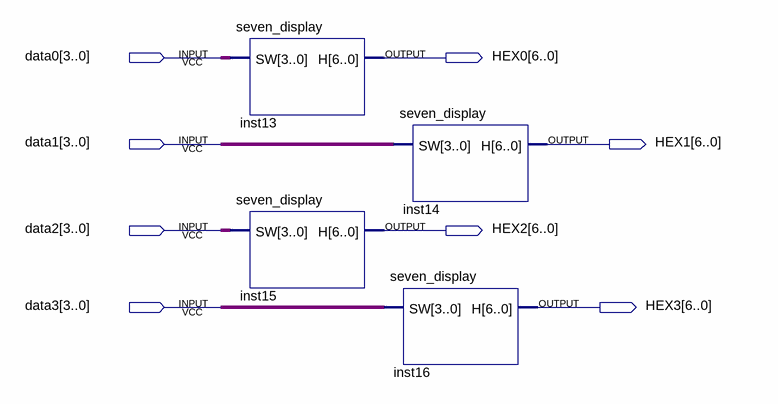
[diagram p0: schematic sheet]
// Quartus schematic seven_display_4by4.bdf as structural Verilog: 4 symbols, 8 pins
module seven_display_4by4 (
  input  [3:0] data0,
  input  [3:0] data1,
  input  [3:0] data2,
  input  [3:0] data3,
  output [6:0] HEX0,
  output [6:0] HEX1,
  output [6:0] HEX2,
  output [6:0] HEX3
);

  seven_display inst13 (.SW(data0), .H(HEX0));
  seven_display inst15 (.SW(data2), .H(HEX2));
  seven_display inst14 (.SW(data1), .H(HEX1));
  seven_display inst16 (.SW(data3), .H(HEX3));
endmodule
